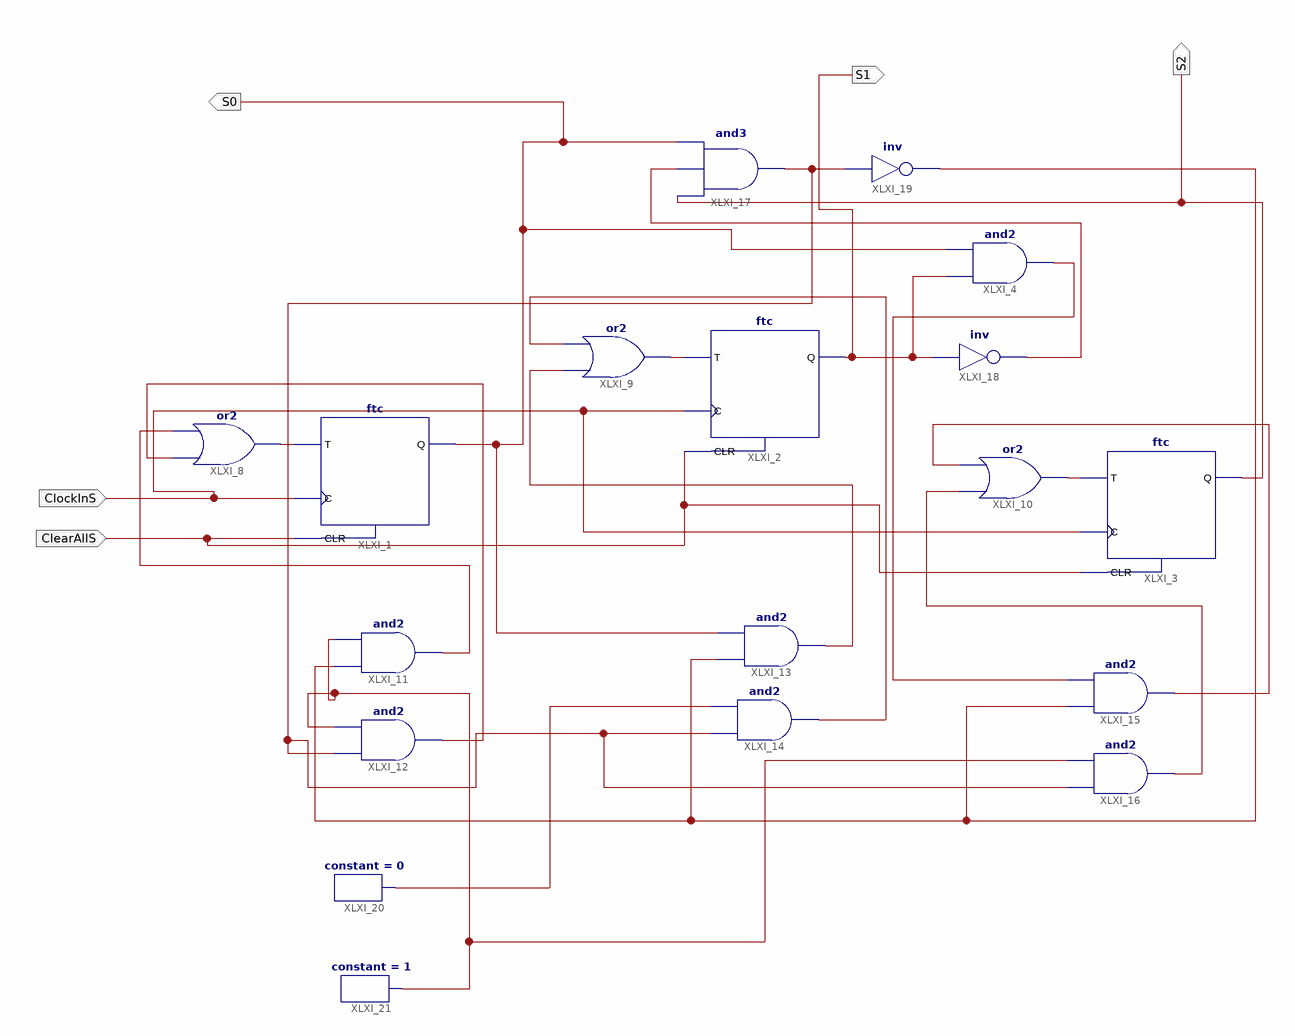
[diagram p0: schematic sheet 1]
// Xilinx ISE schematic DivBySix.sch (spartan6) as structural Verilog: 18 symbols, 5 ports
module DivBySix (
  input  ClearAllS,
  input  ClockInS,
  output S2,
  output S0,
  output S1
);

  wire XLXN_1, XLXN_2, XLXN_3, XLXN_4, XLXN_5, XLXN_6, XLXN_7, XLXN_8, XLXN_9, XLXN_12, XLXN_18, XLXN_20,
       XLXN_23, XLXN_24, XLXN_25;

  ftc XLXI_1 (.C(ClockInS), .CLR(ClearAllS), .T(XLXN_1), .Q(S0));
  ftc XLXI_2 (.C(ClockInS), .CLR(ClearAllS), .T(XLXN_2), .Q(S1));
  ftc XLXI_3 (.C(ClockInS), .CLR(ClearAllS), .T(XLXN_3), .Q(S2));
  and XLXI_4 (XLXN_25, S1, S0);
  or XLXI_8 (XLXN_1, XLXN_5, XLXN_4);
  or XLXI_9 (XLXN_2, XLXN_6, XLXN_7);
  or XLXI_10 (XLXN_3, XLXN_8, XLXN_9);
  and XLXI_11 (XLXN_4, XLXN_24, XLXN_18);
  and XLXI_12 (XLXN_5, XLXN_23, XLXN_18);
  and XLXI_13 (XLXN_6, XLXN_24, S0);
  and XLXI_14 (XLXN_7, XLXN_23, XLXN_20);
  and XLXI_15 (XLXN_9, XLXN_24, XLXN_25);
  and XLXI_16 (XLXN_8, XLXN_23, XLXN_18);
  and XLXI_17 (XLXN_23, S2, XLXN_12, S0);
  not XLXI_18 (XLXN_12, S1);
  not XLXI_19 (XLXN_24, XLXN_23);
  constant #(.CValue("0")) XLXI_20 (.O(XLXN_20));
  constant #(.CValue("1")) XLXI_21 (.O(XLXN_18));
endmodule
